# EAGLE schematic Mbed (EAGLE 6.6.0)
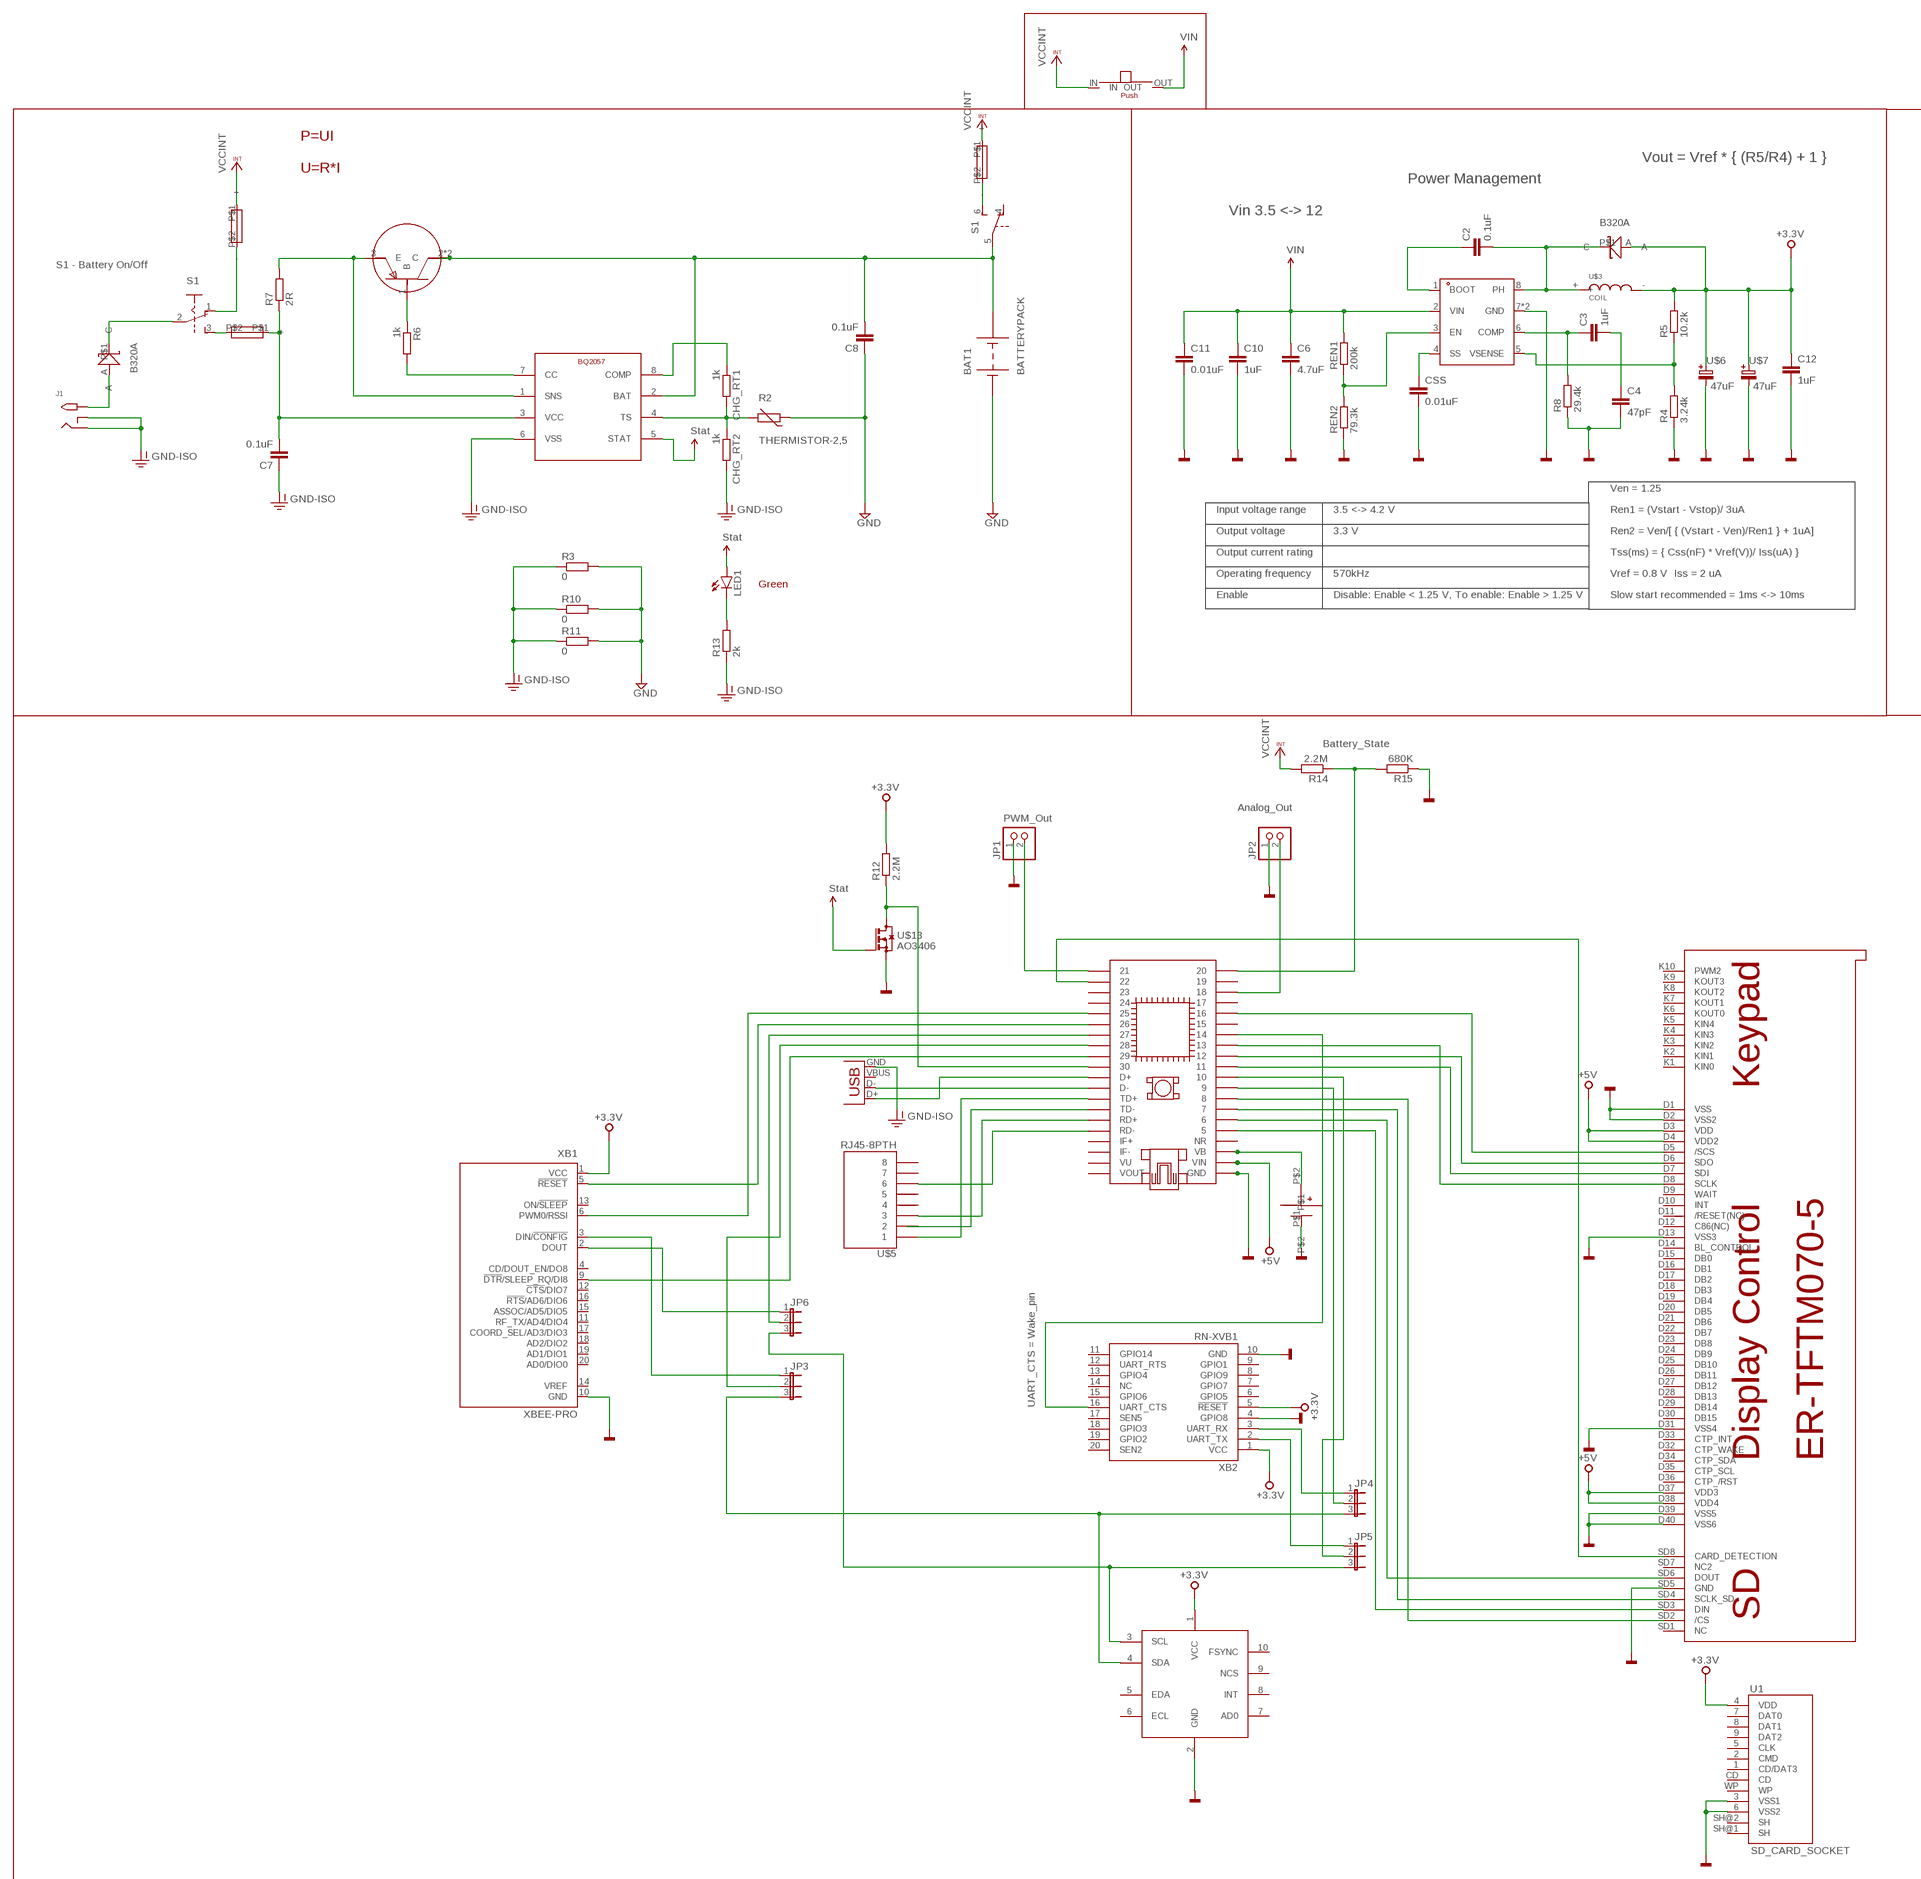
[diagram p0: schematic, sheet 1, part 1 of 2]
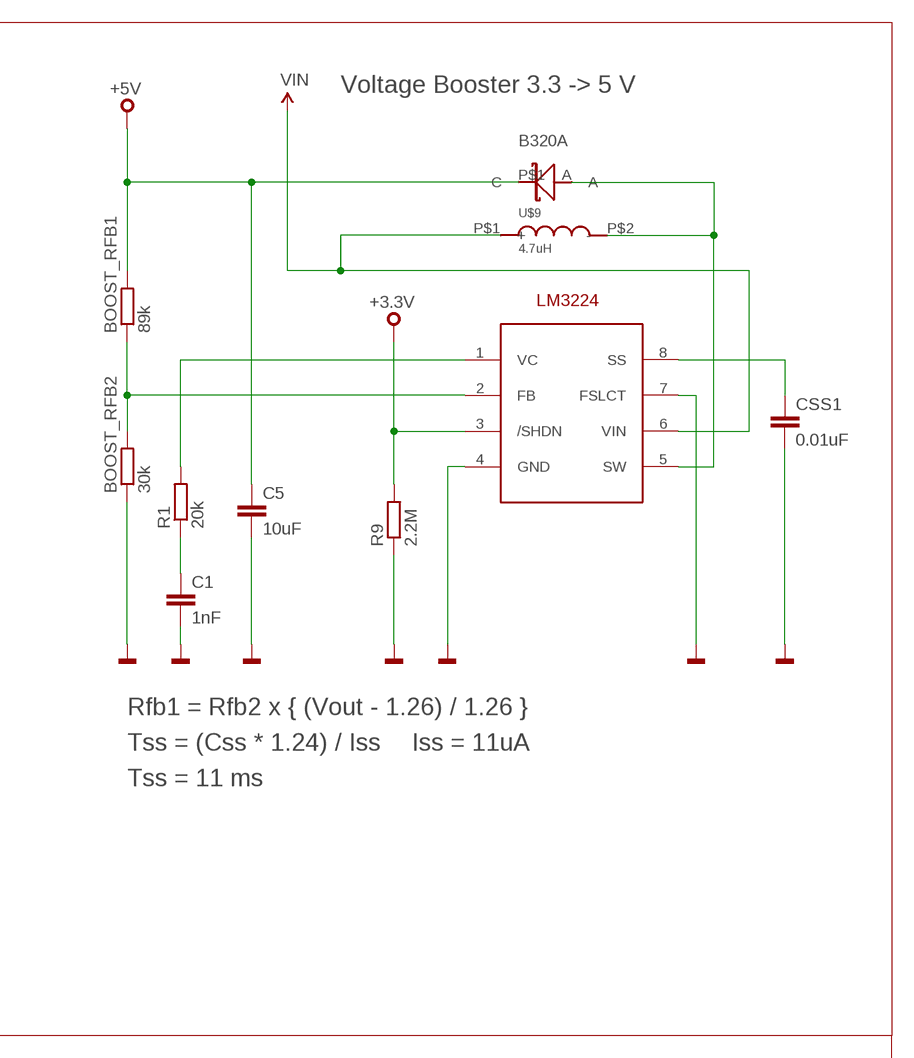
[diagram p1: schematic, sheet 1, part 2 of 2]

## Parts
BAT1  BATTERYPACK  [BATTERYPACK]
BOOST_RFB1  89k  R-EU_M1206  [M1206]
BOOST_RFB2  30k  R-EU_M1206  [M1206]
C1  1nF  C-EUC1206  [C1206]
C2  0.1uF  C-EUC1206  [C1206]
C3  1uF  C-EUC1206  [C1206]
C4  47pF  C-EUC1206  [C1206]
C5  10uF  C-EUC1206  [C1206]
C6  4.7uF  C-EUC1206  [C1206]
C7  0.1uF  C-EUC1206  [C1206]
C8  0.1uF  C-EUC1206  [C1206]
C10  1uF  C-EUC1206  [C1206]
C11  0.01uF  C-EUC1206  [C1206]
C12  1uF  C-EUC1206  [C1206]
CHG_RT1  1k  R-EU_M1206  [M1206]
CHG_RT2  1k  R-EU_M1206  [M1206]
CSS  0.01uF  C-EUC1206  [C1206]
CSS1  0.01uF  C-EUC1206  [C1206]
IC1  MBED-SOCKET  [MBED-SOCKET]
J1  2.1MMJACKTHM  [PJ-102A]
JP1  PINHD-1X2  [1X02]
JP2  PINHD-1X2  [1X02]
JP3  JP2E  [JP2]
JP4  JP2E  [JP2]
JP5  JP2E  [JP2]
JP6  JP2E  [JP2]
LED1  LED3MM  [LED3MM]
R1  20k  R-EU_M1206  [M1206]
R2  THERMISTOR-2,5  [RS-2,5]
R3  0  R-EU_M1206  [M1206]
R4  3.24k  R-EU_M1206  [M1206]
R5  10.2k  R-EU_M1206  [M1206]
R6  1k  R-EU_M1206  [M1206]
R7  2R  R-EU_M1206  [M1206]
R8  29.4k  R-EU_M1206  [M1206]
R9  2.2M  R-EU_M1206  [M1206]
R10  0  R-EU_M1206  [M1206]
R11  0  R-EU_M1206  [M1206]
R12  2.2M  R-EU_M1206  [M1206]
R13  2k  R-EU_M1206  [M1206]
R14  2.2M  R-EU_M1206  [M1206]
R15  680K  R-EU_M1206  [M1206]
REN1  200k  R-EU_M1206  [M1206]
REN2  79.3k  R-EU_M1206  [M1206]
S1  A68-A31  [A68-A31]
U1  SD_CARD_SOCKET  [SD_1:1]
U$1  TPS54331  [R-PDSO-G8]
U$2  ER-TFT070-5  [ER-TFTM070-5]
U$3  COIL  [CD54]
U$4  B220  [SMA]
U$5  RJ45-8PTH  [RJ45-8]
U$6  47uF  POL-CAP-6.2X6  [CAP-6.3X6-NICHICON]
U$7  47uF  POL-CAP-6.2X6  [CAP-6.3X6-NICHICON]
U$8  LM3224  [MSSOP-8]
U$9  4.7uH  COIL-CD43  [CD43]
U$10  B220  [SMA]
U$11  BQ2057  [SOIC-8]
U$12  FZT788B  [SOT-223]
U$13  AO3406  [SOT23]
U$14  BHOLDER  [BS-CR2032M]
U$15  B220  [SMA]
U$16  MPU-9250  [MPU9250]
U$17  FUSE  [1808]
U$18  FUSE  [1808]
U$19  SWITCH_PUSH_LATCH  [YT-1712-KD]
U$20  FUSE  [1808]
X1  USB-MB-H  [USB-MB-H]
XB1  XBEE-PRO  [XBEE-PRO]
XB2  RN-XVB1  [XBEE]

## Nets
1.0V: LED1.A U$11.5(STAT) U$13.1(G) ; supply symbol labelled Stat
+3,3V: C12.1 R5.2 R9.2 R12.2 U1.4(VDD) U$3.- U$4.A U$6.+ U$7.+ U$8.3(/SHDN) U$16.1(VCC) XB1.1(VCC) XB2.1(VCC) XB2.5(!RESET) ; supply symbol labelled +3.3V
+5V: BOOST_RFB1.2 C5.1 IC1.VIN IC1.VINA U$2.D3(VDD) U$2.D4(VDD2) U$2.D37(VDD3) U$2.D38(VDD4) U$10.P$1(C)
GND: BAT1.GND BOOST_RFB2.1 C1.2 C4.2 C5.2 C6.2 C8.1 C10.2 C11.2 C12.2 CSS1.2 CSS.2 IC1.GND IC1.GNDA JP1.1 JP2.1 R2.1 R3.2 R4.1 R8.1 R9.1 R10.2 R11.2 R15.1 REN2.1 U1.3(VSS1) U1.6(VSS2) U$1.7(GND) U$1.P$9(GND) U$2.D1(VSS) U$2.D2(VSS2) U$2.D13(VSS3) U$2.D31(VSS4) U$2.D39(VSS5) U$2.D40(VSS6) U$2.SD5(GND) U$6.- U$7.- U$8.4(GND) U$8.7(FSLCT) U$13.2(S) U$14.P$1 U$16.2(GND) XB1.10(GND) XB2.4(GPIO8) XB2.10(GND)
GND-ISO: C7.1 CHG_RT2.2 J1.RING J1.RING_SW R3.1 R10.1 R11.1 R13.1 U$11.6(VSS) X1.GND
IMU_SCL: JP5.3 JP6.3 U$16.3(SCL)
IMU_SDA: JP3.3 JP4.3 U$16.4(SDA)
MBED_RX_P10: IC1.10 JP5.2
MBED_RX_P27: IC1.27 JP6.2
MBED_TX_P9: IC1.9 JP4.2
MBED_TX_P28: IC1.28 JP3.2
N$1: REN1.1 REN2.2 U$1.3(EN)
N$2: R6.2 U$11.7(CC)
N$3: CSS.1 U$1.4(SS)
N$4: C2.1 U$1.1(BOOT)
N$5: C2.2 U$1.8(PH) U$3.+ U$4.P$1(C)
N$6: X1.D+
N$7: R4.2 R5.1 U$1.5(VSENSE)
N$8: X1.D-
N$9: C3.1 R8.2 U$1.6(COMP)
N$10: C3.2 C4.1
N$11: S1.1(A:O) U$17.P$2(-)
N$12: S1.2(A:P) U$15.P$1(C)
N$13: R1.2 U$8.1(VC)
N$14: U$15.A
N$15: S1.6(B:S) U$18.P$2(-)
N$16: S1.3(A:S) U$20.P$2(-)
N$17: LED1.K(C) R13.2
N$18: C7.2 R7.1 U$11.3(VCC) U$20.P$1(+)
N$20: R12.1 U$13.3(D)
N$21: R6.1 U$12.1(B)
N$22: U$5.1
N$24: C1.1 R1.1
N$25: BOOST_RFB1.1 BOOST_RFB2.2 U$8.2(FB)
N$26: CSS1.1 U$8.8(SS)
N$27: U$8.5(SW) U$9.P$2(-) U$10.A
N$28: R7.2 U$11.1(SNS) U$12.3(E)
N$29: U$5.3
N$30: BAT1.V C8.2 S1.5(B:P) U$11.2(BAT) U$12.2(C) U$12.4(C)
N$31: U$5.6
N$32: CHG_RT1.2 CHG_RT2.1 R2.2 U$11.4(TS)
N$33: IC1.22 U$2.SD8(CARD_DETECTION)
N$34: IC1.16 U$2.D5(/SCS)
N$35: IC1.13 U$2.D8(SCLK)
N$36: IC1.12 U$2.D6(SDO)
N$37: IC1.11 U$2.D7(SDI)
N$38: CHG_RT1.1 U$11.8(COMP)
N$39: IC1.8 U$2.SD2(/CS)
N$40: IC1.7 U$2.SD4(SCLK_SD)
N$41: IC1.6 U$2.SD6(DOUT)
N$42: IC1.5 U$2.SD3(DIN)
N$45: IC1.18 JP2.2
N$46: IC1.26 XB1.5(!RESET)
N$47: JP4.1 XB2.3(UART_RX)
N$48: IC1.14 XB2.16(UART_CTS)
N$49: IC1.21 JP1.2
N$50: IC1.20 R14.1 R15.2
N$51: IC1.VB IC1.VBA U$14.P$2
N$54: JP5.1 XB2.2(UART_TX)
N$55: IC1.29 XB1.9(!DTR!/SLEEP_RQ/DI8)
N$56: IC1.25 XB1.6(PWM0/RSSI)
VCCINT: R14.2 U$17.P$1(+) U$18.P$1(+) U$19.IN
VIN: C6.1 C10.1 C11.1 REN1.2 U$1.2(VIN) U$8.6(VIN) U$9.P$1(+) U$19.OUT
XBEE_DIN: JP3.1 XB1.3(DIN/!CONFIG)
XBEE_DOUT: JP6.1 XB1.2(DOUT)
Unconnected: IC1.5A IC1.6A IC1.7A IC1.8A IC1.9A IC1.10A IC1.11A IC1.12A IC1.13A IC1.14A IC1.15 IC1.15A IC1.16A IC1.17 IC1.17A IC1.18A IC1.19 IC1.19A IC1.20A IC1.21A IC1.22A IC1.23 IC1.23A IC1.24 IC1.24A IC1.25A IC1.26A IC1.27A IC1.28A IC1.29A IC1.30 IC1.30A IC1.D+ IC1.D+A IC1.D- IC1.D-A IC1.IF+ IC1.IF+A IC1.IF- IC1.IF-A IC1.NR IC1.NRA IC1.RD+ IC1.RD+A IC1.RD- IC1.RD-A IC1.TD+ IC1.TD+A IC1.TD- IC1.TD-A IC1.VOUT IC1.VOUTA IC1.VU IC1.VUA J1.TIP S1.4(B:O) U1.1(CD/DAT3) U1.2(CMD) U1.5(CLK) U1.7(DAT0) U1.8(DAT1) U1.9(DAT2) U1.CD U1.SH@1(SH) U1.SH@2(SH) U1.WP U$2.D9(WAIT) U$2.D10(INT) U$2.D11(/RESET(NC)) U$2.D12(C86(NC)) U$2.D14(BL_CONTROL) U$2.D15(DB0) U$2.D16(DB1) U$2.D17(DB2) U$2.D18(DB3) U$2.D19(DB4) U$2.D20(DB5) U$2.D21(DB6) U$2.D22(DB7) U$2.D23(DB8) U$2.D24(DB9) U$2.D25(DB10) U$2.D26(DB11) U$2.D27(DB12) U$2.D28(DB13) U$2.D29(DB14) U$2.D30(DB15) U$2.D32(CTP_WAKE) U$2.D33(CTP_INT) U$2.D34(CTP_SDA) U$2.D35(CTP_SCL) U$2.D36(CTP_/RST) U$2.K1(KIN0) U$2.K2(KIN1) U$2.K3(KIN2) U$2.K4(KIN3) U$2.K5(KIN4) U$2.K6(KOUT0) U$2.K7(KOUT1) U$2.K8(KOUT2) U$2.K9(KOUT3) U$2.K10(PWM2) U$2.SD1(NC) U$2.SD7(NC2) U$5.2 U$5.4 U$5.5 U$5.7 U$5.8 U$16.5(EDA) U$16.6(ECL) U$16.7(AD0) U$16.8(INT) U$16.9(NCS) U$16.10(FSYNC) X1.VBUS XB1.4(CD/DOUT_EN/DO8) XB1.11(RF_TX/AD4/DIO4) XB1.12(!CTS!/DIO7) XB1.13(ON/!SLEEP) XB1.14(VREF) XB1.15(ASSOC/AD5/DIO5) XB1.16(!RTS!/AD6/DIO6) XB1.17(COORD_SEL/AD3/DIO3) XB1.18(AD2/DIO2) XB1.19(AD1/DIO1) XB1.20(AD0/DIO0) XB2.6(GPIO5) XB2.7(GPIO7) XB2.8(GPIO9) XB2.9(GPIO1) XB2.11(GPIO14) XB2.12(UART_RTS) XB2.13(GPIO4) XB2.14(NC) XB2.15(GPIO6) XB2.17(SEN5) XB2.18(GPIO3) XB2.19(GPIO2) XB2.20(SEN2)

## Notes on the sheet
- P=UI
- Voltage Booster 3.3 -> 5 V
- Vout = Vref * { (R5/R4) + 1 }
- U=R*I
- Power Management
- Vin 3.5 <-> 12
- S1 - Battery On/Off
- Ven = 1.25
- Input voltage range | 3.5 <-> 4.2 V | Ren1 = (Vstart - Vstop)/ 3uA
- Rfb1 = Rfb2 x { (Vout - 1.26) / 1.26 }
- Output voltage | 3.3 V | Ren2 = Ven/[ { (Vstart - Ven)/Ren1 } + 1uA]
- Tss = (Css * 1.24) / Iss | Iss = 11uA
- Output current rating | Tss(ms) = { Css(nF) * Vref(V))/ Iss(uA) }
- Tss = 11 ms
- Operating frequency | 570kHz | Vref = 0.8 V | Iss = 2 uA
- Green
- Enable | Disable: Enable < 1.25 V, To enable: Enable > 1.25 V | Slow start recommended = 1ms <-> 10ms
- Battery_State
- Analog_Out
- PWM_Out
- UART_CTS = Wake_pin

## Library data of the parts
BAT1 = mbed-power:BATTERYPACK
BOOST_RFB1 BOOST_RFB2 CHG_RT1 CHG_RT2 R1 R3-R15 REN1 REN2 = rcl:R-EU_: RESISTOR, European symbol
C1-C6 C10-C12 CSS CSS1 = resistor:C-EU: CAPACITOR, European symbol
C7 C8 = rcl:C-EU: CAPACITOR, European symbol
IC1 = mbed-microcontroller:MBED-SOCKET
J1 = adafruit:2.1MMJACK: 2.1mm x 5.5mm THM DC jack with internal switch. Digikey part #PJ-102A, 4UCON part #05537 2.1mm x 5.5mm SMT DC jack with internal switch. Digikey part #PJ-002A-SMT, 4UCON part #03267 By microbuilder.eu & adafruit.com
JP1 JP2 = pinhead:PINHD-1X2: PIN HEADER
JP3-JP6 = jumper:JP2E: JUMPER
LED1 = SparkFun-LED:LED: LEDs Standard schematic elements and footprints for 5mm, 3mm, 1206, and 0603 sized LEDs. 5mm - Spark Fun Electronics SKU : COM-00529 (and others)
R2 = varistor:THERMISTOR: THERMISTOR
S1 = switch:A68-A31: SLIDING SWITCH Siemens, distributor Buerklin, 11G766
U1 = SparkFun-Connectors:SD_CARD_SOCKET: SD Memory Card Connector, push-push normal type, CD enable, WP enable
U$1 = Oma:TPS54331
U$2 = ReskiT:ER-TFT070-5
U$3 = Oma:COIL
U$4 U$10 U$15 = Oma:B220
U$5 = SparkFun-Connectors:RJ45-8: RJ45 Jack Simple RJ45, 8-pin connection - connector for common Cat5, Cat5e, and Cat6 Ethernet cables. Footprint not yet proven in production. Connector sku is PRT-00643; Breakout PCB sku is BOB-00716.
U$6 U$7 = Oma:POL-CAP-6.2X6
U$8 = Oma:LM3224
U$9 = Oma:COIL-CD43
U$11 = Oma:BQ2057
U$12 = Oma:FZT788B
U$13 = Oma:AO3406
U$14 = Oma:BHOLDER
U$16 = Oma:MPU-9250
U$17 U$18 U$20 = Oma:FUSE
U$19 = Oma:SWITCH_PUSH_LATCH
X1 = mbed-connectors:USB: USB Connectors
XB1 = maxstream:XBEE: XBee (TM) /XBee-PRO(TM) OEM RF Modules Source: MaxStream, Inc. xbee_productmanual.pdf; MPN: XBP24-AWI-001; OC_FARNELL: 1337916; OC_NEWARK: 42M2667
XB2 = SteveMarple:RN-XV